# Altium schematic sheet TDC.SchDoc
size A; SheetNumber: 3; SheetTotal: 3
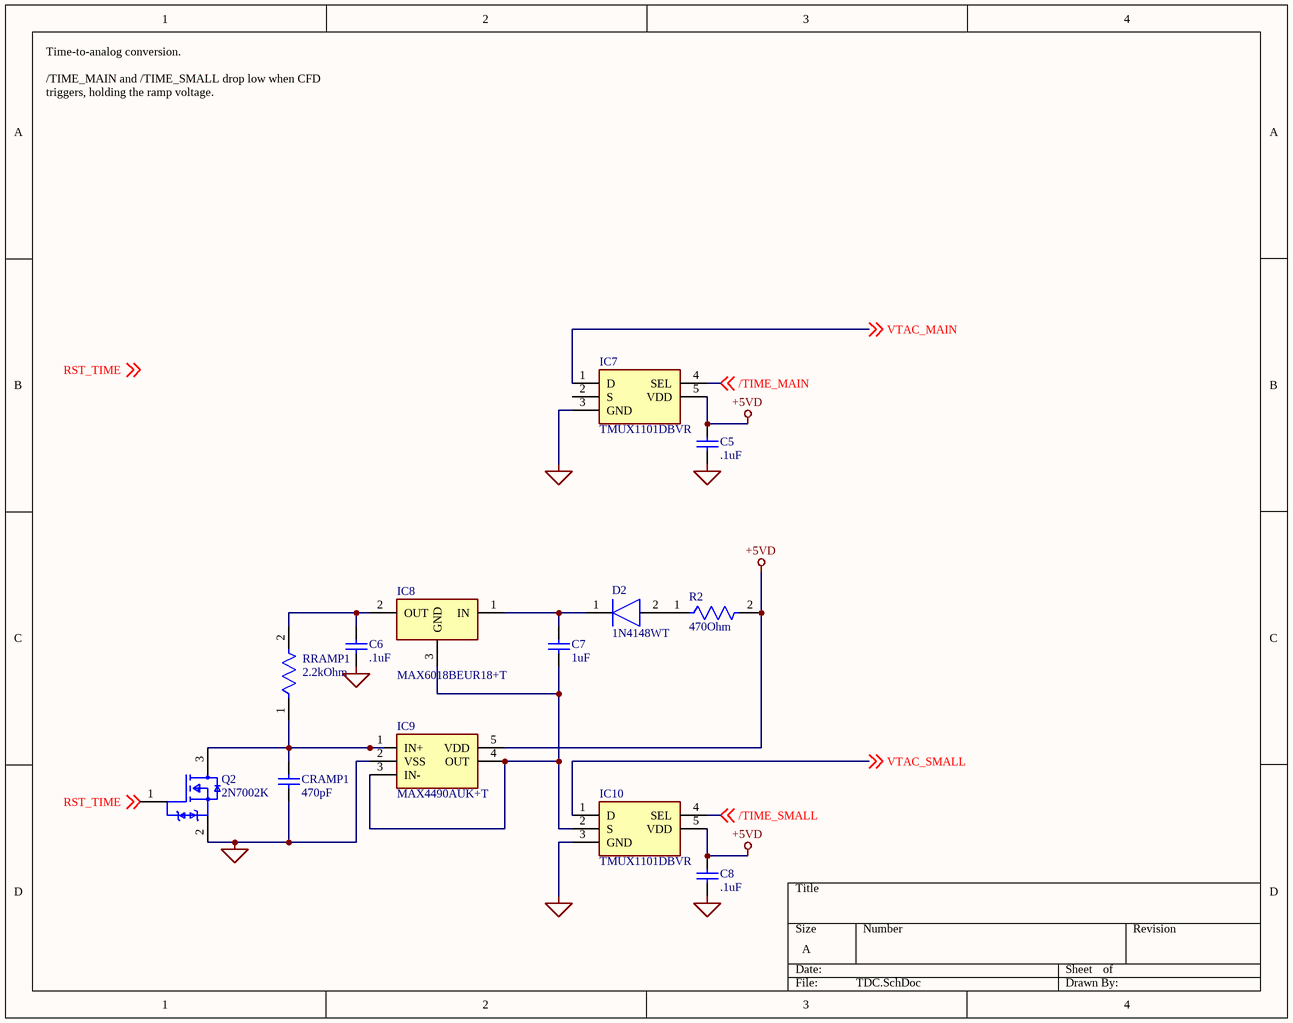
[diagram p0: TDC.SchDoc]

## Parts
C5  .1uF  [CAPC2013X140X45NL15T25]
C6  .1uF  [CAPC2013X140X45NL15T25]
C7  1uF  [CAPC2013X140X45NL15T25]
C8  .1uF  [CAPC2013X140X45NL15T25]
CRAMP1  470pF  [CAPC2013X140X45NL15T25]
D2  1N4148WT  [SODFL1608X70N]
IC7  TMUX1101DBVR  [SOT95P280X145-5N]
IC8  MAX6018BEUR18+T  [SOT95P237X112-3N]
IC9  MAX4490AUK+T  [SOT95P280X145-5N]
IC10  TMUX1101DBVR  [SOT95P280X145-5N]
Q2  2N7002K  [FP-318-08-MFG]
R2  470Ohm  [FP-CRCW0402-e3-IPC_C]
RRAMP1  2.2kOhm  [FP-CRCW0603-e3-MFG]

## Nets
+5VD: C5.2 C8.2 IC7.5(VDD) IC9.5(VDD) IC10.5(VDD) R2.2
GND: C5.1 C6.1 C8.1 CRAMP1.1 IC7.3(GND) IC9.2(VSS) IC10.3(GND) Q2.2(Source)
/TIME_MAIN: IC7.4(SEL) ; off-sheet /TIME_MAIN
/TIME_SMALL: IC10.4(SEL) ; off-sheet /TIME_SMALL
RST_TIME: Q2.1(Gate) ; off-sheet RST_TIME
VTAC_MAIN: IC7.1(D) ; off-sheet VTAC_MAIN
VTAC_SMALL: IC10.1(D) ; off-sheet VTAC_SMALL
NetC6_2: C6.2 IC8.2(OUT) RRAMP1.2
NetC7_1: C7.1 IC8.3(GND) IC9.3(IN-) IC9.4(OUT) IC10.2(S)
NetC7_2: C7.2 D2.1(K) IC8.1(IN)
NetCRAMP1_2: CRAMP1.2 IC9.1(IN+) Q2.3(Drain) RRAMP1.1
NetD2_2: D2.2(A) R2.1

Not connected (* = marked no-connect by the designer): IC7 2(S)

## Notes on the sheet
- Time-to-analog conversion.
  /TIME_MAIN and /TIME_SMALL drop low when CFD triggers, holding the ramp voltage.
- Labels drawn without touching a wire or pin: RST_TIME

## Library data of the parts
C5-C8 CRAMP1 = CMP-2007-03395-1: 0402; Part Number: GRM21BR71A106KE51L; Manufacturer: Murata
D2 = 1N4148WT: Diode; Manufacturer_Name: SEMTECH; Datasheet Link: https://datasheet.lcsc.com/szlcsc/Semtech-1N4148WT_C27748.pdf; Height: 0.7mm; Manufacturer_Part_Number: 1N4148WT
IC7 IC10 = TMUX1101DBVR: Analog Switch ICs 3-pA on-state leakage current, 5-V, 1:1 (SPST), 1-channel precision switch (active low) 5-SOT-23 -40 to 125; Manufacturer_Name: Texas Instruments; Datasheet Link: https://www.ti.com/lit/ds/symlink/tmux1101.pdf?ts=1618527438207; Height: 1.45mm; Manufacturer_Part_Number: TMUX1101DBVR
IC8 = MAX6018BEUR18+T: Voltage References Precision, Micropower, 1.8V Supply, Low-Dropout, SOT23 Voltage Reference; Manufacturer_Name: Maxim Integrated; Datasheet Link: https://pdfserv.maximintegrated.com/en/ds/MAX6018-MAX6018B.pdf; Height: 1.12mm; Manufacturer_Part_Number: MAX6018BEUR18+T
IC9 = MAX4490AUK+T: Integrated Circuit; Manufacturer_Name: Maxim Integrated; Datasheet Link: https://pdfserv.maximintegrated.com/en/ds/MAX4490-MAX4492.pdf; Height: 1.45mm; Manufacturer_Part_Number: MAX4490AUK+T
Q2 = CMP-07173-000009-1: MOSFET N-CH 60V 300MA SOT23; Manufacturer: ON Semiconductor; Turn Off Delay Time: 55.8ns; Max Forward Diode Voltage: 1.2V; Max Junction Temp: +150°C; Pulse Drain Current: 5A; Threshold Vgs Min: 1V; Depletion Mode: False; Drain To Source Resistance: 1.19Ω; Number Of N Channels: 1; Standoff Height: 0.01mm; Rthja Max: 417°C/W; Input Capacitace At Vds: 24.5pF @ 20V; Threshold Vgs Max: 2.3V; Turn On Delay Time: 12.2ns; Gate Charge At Vgs: 0.7nC @ 4.5V; Continuous Drain Current: 320mA; Transconductance: 0.53S; Power Dissipation: 300mW; Gate To Source Voltage: 20V; Typ Forward Diode Voltage: 0.8V; ComponentLink2URL: https://www.onsemi.com/pub/Collateral/2N7002K-D.pdf; RoHS: TRUE; Device Class L1: Discrete Semiconductors; ComponentLink2Description: Datasheet; Manufacturer Part Number: 2N7002K; Octopart: https://octopart.com/2n7002k-on+semiconductor-84408900; Device Class L3: MOSFETs; Mouser Description: N-Channel 60 V 2 Ohm SMT Enhancement Mode Field Effect Transistor SOT-23; Ipc Land Pattern Name: SOT95P240X100-3; Temperature Range High: +150°C; Temperature Range Low: -55°C; Lead Free: Yes; Height: 1.11mm; Package: 318-08; Footprint Url: https://www.onsemi.com/pub/Collateral/318-08.PDF; Temperature: -55°C to +150°C; Drain To Source Voltage: 60V; Device Class L2: Transistors; Drain To Source Breakdown Voltage: 60V; Digikey Description: MOSFET N-CH 60V 300MA SOT23; Number Of Channels: 1; Category: Trans; Automotive: No
R2 = CMP-2002-08122-2: RES Thick Film, 0Ω, 0.063W, 0402; Tolerance: 5%; Max Power Dissipation: 63mW; Voltage Rating: 50V; Temperature Coefficient: 100ppm/°C; Resistance: 0mR; Contact Plating: Tin; Height: 0.35mm; Radiation Hardening: No; Features: Automotive AEC-Q200; Composition: Thick Film; Width: 0.5mm; Weight: 2.3E-05oz; Termination: SMD/SMT; Packaging: Tape and Reel; Mount: Surface Mount; Case Code (Metric): 1005; Military Standard: Not; Min Operating Temperature: -55°C; Number of Terminations: 2; Package Quantity: 1; Case Code (Imperial): 0402; Depth: 0.5mm; Max Operating Temperature: 155°C; Case/Package: 0402; Power Rating: 63mW; Lead Free: Lead Free; Voltage Rating (DC): 50V; Length: 1mm
RRAMP1 = CMP-2000-03013-2: RES Thick Film, 1MΩ, 1%, 0.1W, 100ppm/°C, 0603; Max Power Dissipation: 100mW; Resistance: 1MR; Voltage Rating (DC): 75V; Depth: 0.85mm; Max Operating Temperature: 155°C; Length: 1.55mm; Power Rating: 100mW; Military Standard: Not; Features: Automotive AEC-Q200; Min Operating Temperature: -55°C; Number of Pins: 2; Mount: Surface Mount; Package Quantity: 10; Packaging: Tape and Reel; Height: 0.45mm; Radiation Hardening: No; Case Code (Metric): 1608; Temperature Coefficient: 100ppm/°C; Width: 0.85mm; Composition: Thick Film; Termination: SMD/SMT; Tolerance: 1%; Number of Terminations: 2; Lead Free: Lead Free; Contact Plating: Tin; Case/Package: 0603; Weight: 7.1E-05oz; Voltage Rating: 75V; Case Code (Imperial): 0603